# EAGLE schematic 可控硅控制 (EAGLE 6.3)
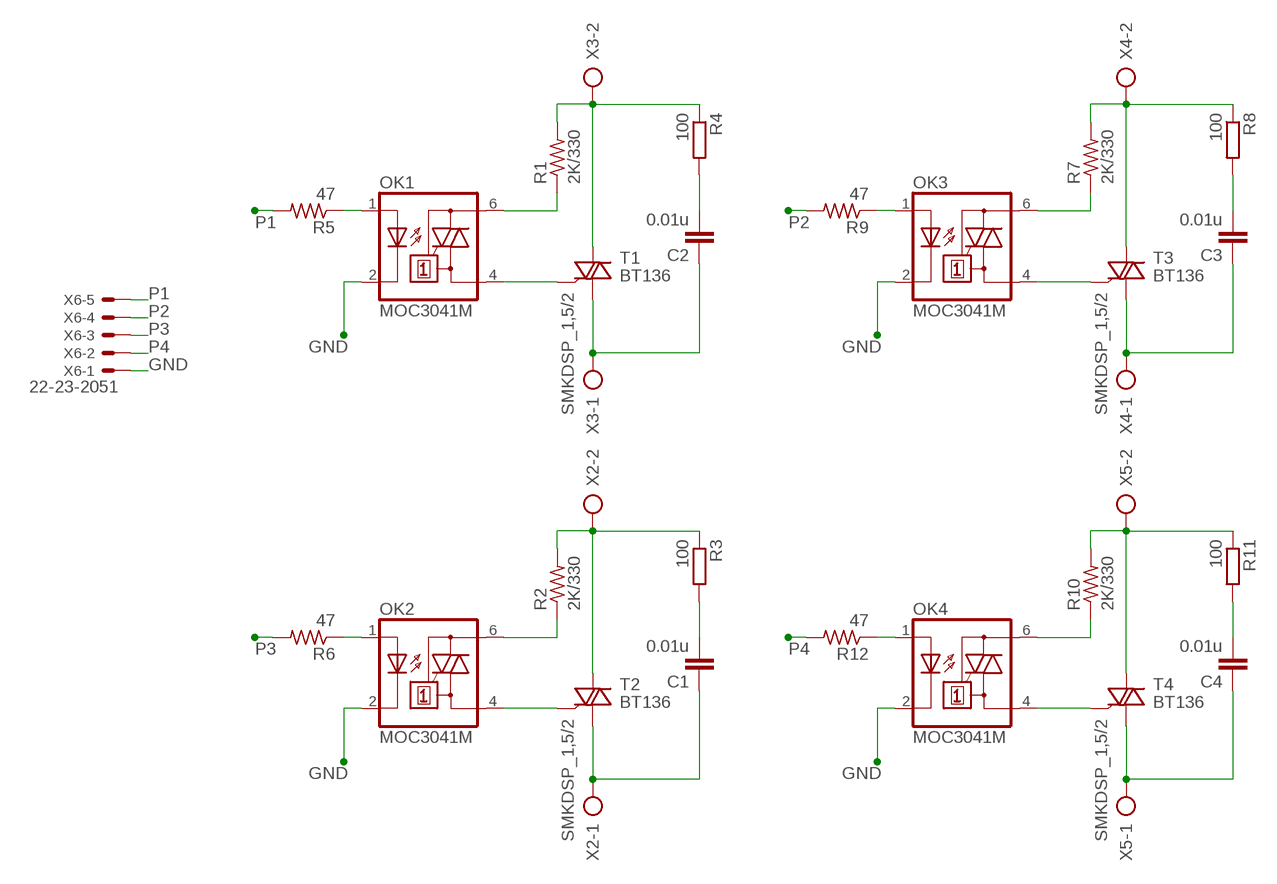
[diagram p0: schematic, sheet 1]

## Parts
C1  0.01u  C-EU050-024X044  [C050-024X044]
C2  0.01u  C-EU050-024X044  [C050-024X044]
C3  0.01u  C-EU050-024X044  [C050-024X044]
C4  0.01u  C-EU050-024X044  [C050-024X044]
OK1  MOC3041M  [DIL06]
OK2  MOC3041M  [DIL06]
OK3  MOC3041M  [DIL06]
OK4  MOC3041M  [DIL06]
R1  2K/330  R-US_0204/7  [0204/7]
R2  2K/330  R-US_0204/7  [0204/7]
R3  100  R-EU_0204/7  [0204/7]
R4  100  R-EU_0204/7  [0204/7]
R5  47  R-US_0204/7  [0204/7]
R6  47  R-US_0204/7  [0204/7]
R7  2K/330  R-US_0204/7  [0204/7]
R8  100  R-EU_0204/7  [0204/7]
R9  47  R-US_0204/7  [0204/7]
R10  2K/330  R-US_0204/7  [0204/7]
R11  100  R-EU_0204/7  [0204/7]
R12  47  R-US_0204/7  [0204/7]
T1  BT136  [TO220AB]
T2  BT136  [TO220AB]
T3  BT136  [TO220AB]
T4  BT136  [TO220AB]
X2  SMKDSP_1,5/2  [SMKDSP_1,5/2]
X3  SMKDSP_1,5/2  [SMKDSP_1,5/2]
X4  SMKDSP_1,5/2  [SMKDSP_1,5/2]
X5  SMKDSP_1,5/2  [SMKDSP_1,5/2]
X6  22-23-2051  [22-23-2051]

## Nets
11: OK1.1(A) R5.1
22: OK3.1(A) R9.1
33: OK4.1(A) R12.1
44: OK2.1(A) R6.1
A1: R1.2 R4.1 T1.2(A2) X3.2
A2: C2.1 T1.1(A1) X3.1
B1: R7.2 R8.1 T3.2(A2) X4.2
B2: C3.1 T3.1(A1) X4.1
C1: R2.2 R3.1 T2.2(A2) X2.2
C2: C1.1 T2.1(A1) X2.1
D1: R10.2 R11.1 T4.2(A2) X5.2
D2: C4.1 T4.1(A1) X5.1
GND: OK1.2(C) OK2.2(C) OK3.2(C) OK4.2(C) X6.1
N$1: OK1.6(A2) R1.1
N$2: OK1.4(A1) T1.3(G)
N$3: C2.2 R4.2
N$4: OK2.6(A2) R2.1
N$5: OK2.4(A1) T2.3(G)
N$7: C1.2 R3.2
N$8: OK3.6(A2) R7.1
N$9: OK3.4(A1) T3.3(G)
N$12: C3.2 R8.2
N$13: OK4.6(A2) R10.1
N$14: OK4.4(A1) T4.3(G)
N$16: C4.2 R11.2
P1: R5.2 X6.5
P2: R9.2 X6.4
P3: R6.2 X6.3
P4: R12.2 X6.2

## Library data of the parts
C1-C4 = resistor:C-EU: CAPACITOR, European symbol
OK1-OK4 = optocoupler:MOC30*: 6-Pin DIP Zero-Cross Optoisolators Triac Driver Output (250/400 Volt Peak) Source: http://www.fairchildsemi.com/ds/MO/MOC3043-M.pdf; MF: FAIRCHILD SEMICONDUCTOR; MPN: MOC3041M; OC_FARNELL: 1086677; OC_NEWARK: 78K6090
R1 R2 R5-R7 R9 R10 R12 = resistor:R-US_: RESISTOR, American symbol
R3 R4 R8 R11 = resistor:R-EU_: RESISTOR, European symbol
T1-T4 = triac:BT136: Triac BT136 series E sensitive gate Source: http://www.nxp.com/acrobat_download/datasheets/BT136_SERIES_E_2.pdf
X2-X5 = con-phoenix-smkdsp:SMKDSP_1,5/2: Printklemme, Nennstrom: 17,5 A, Bemessungsspannung: 250 V, Raster: 5,0 mm Source: http://eshop.phoenixcontact.de .. 1733415.pdf; MF: FARNELL; MPN: 1733570; OC_FARNELL: 3041244; OC_NEWARK: 69C8588
X6 = con-molex:22-23-2051: .100" (2.54mm) Center Header - 5 Pin; MF: MOLEX; MPN: 22-23-2051; OC_FARNELL: 1462952; OC_NEWARK: 38C9178